# EAGLE schematic WagaGSMv3 (EAGLE 9.0.1)
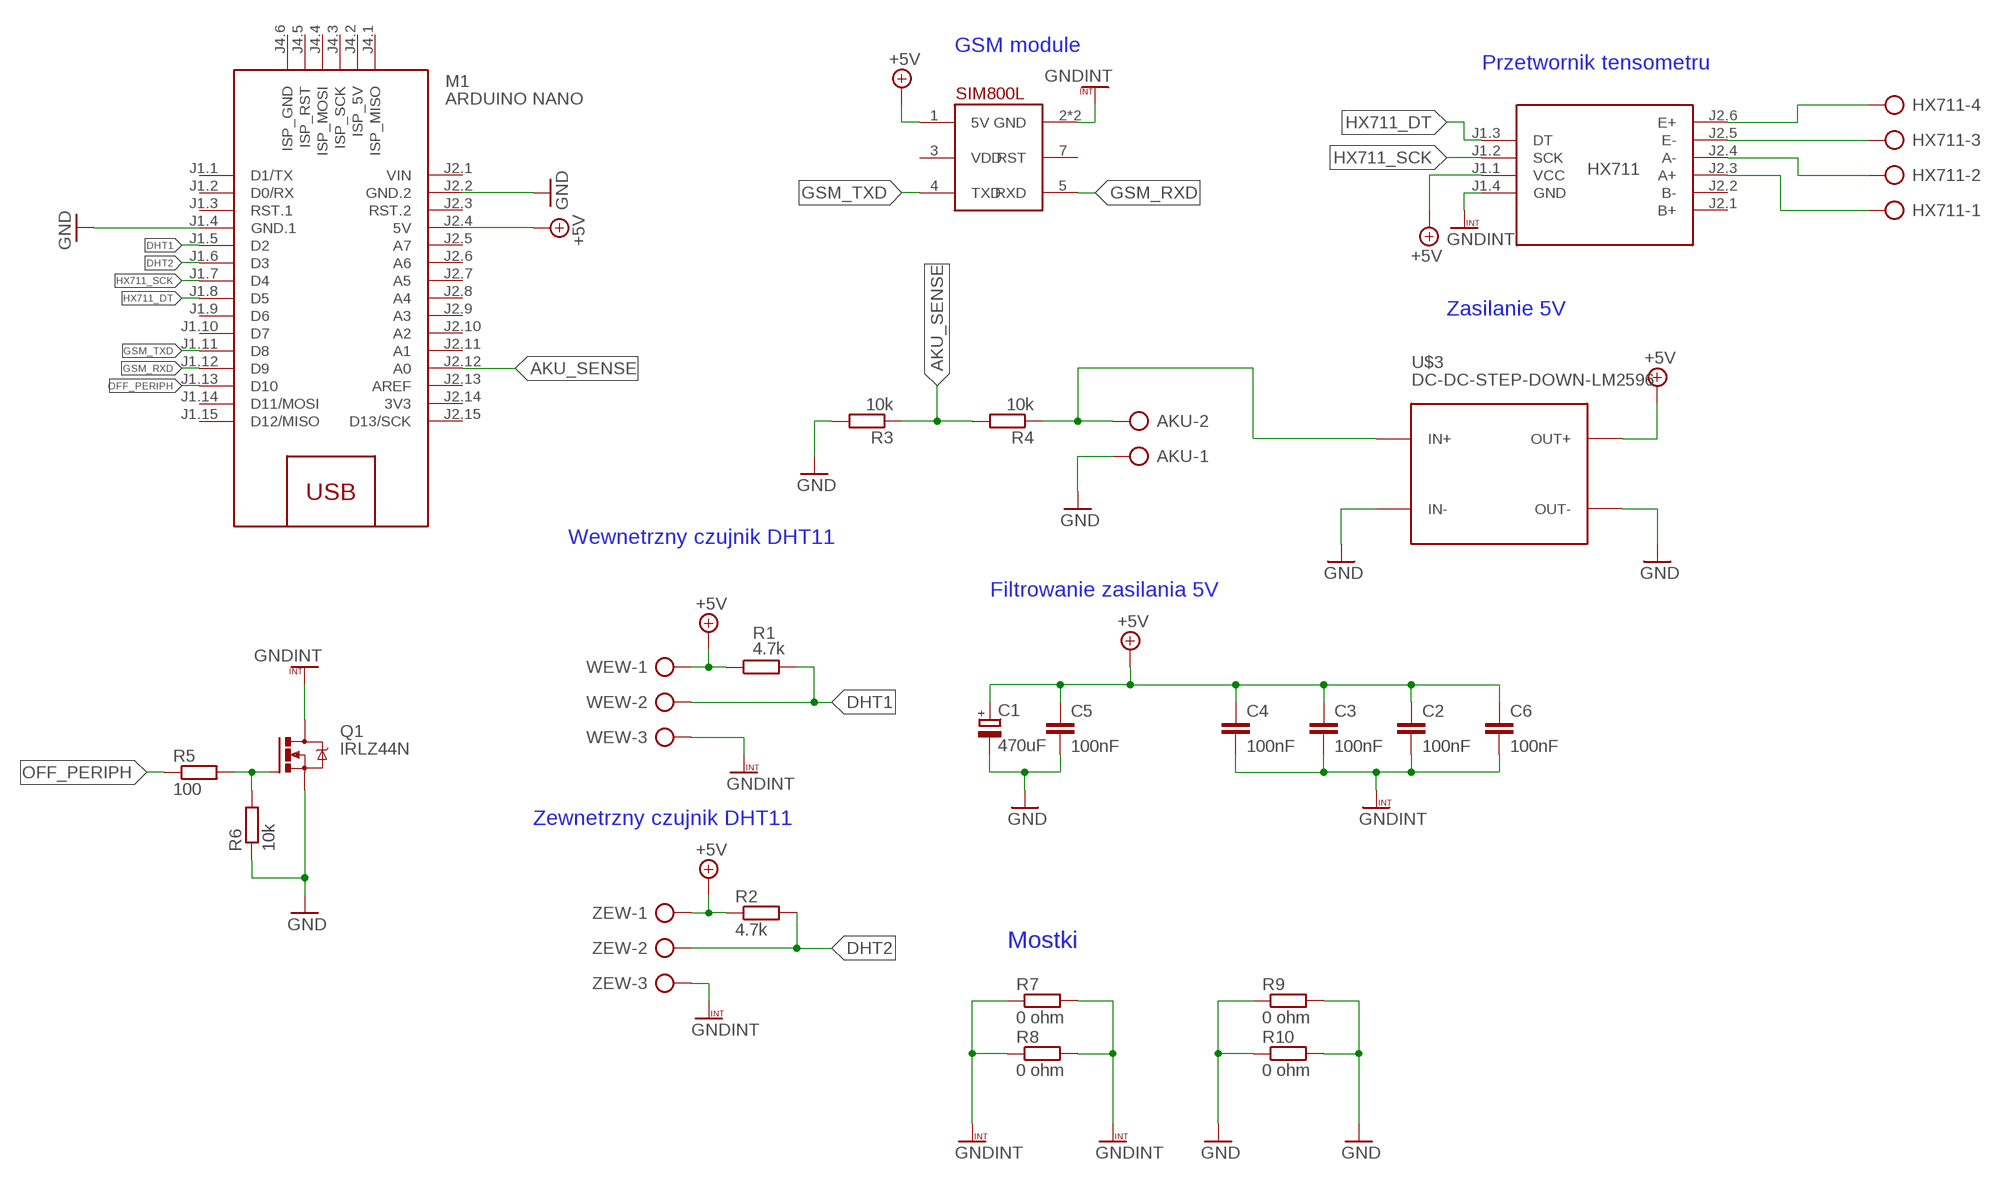
[diagram p0: schematic, sheet 1]

## Parts
AKU  AK500/2-H  [AK500/2-H]
C1  470uF  CPOL-EUE5-10.5  [E5-10,5]
C2  100nF  C-EU050-030X075  [C050-030X075]
C3  100nF  C-EU050-030X075  [C050-030X075]
C4  100nF  C-EU050-030X075  [C050-030X075]
C5  100nF  C-EU050-030X075  [C050-030X075]
C6  100nF  C-EU050-030X075  [C050-030X075]
HX711  AK300/4  [AK300/4]
M1  ARDUINO NANO  ARDUINO-NANO-3.0#ISP  [ARDUINO-NANO-3.0#ISP]
Q1  IRLZ44N  IRFZ48Z  [TO220BH]
R1  4.7k  R-EU_0204/7  [0204/7]
R2  4.7k  R-EU_0204/7  [0204/7]
R3  10k  R-EU_0207/10  [0207/10]
R4  10k  R-EU_0207/10  [0207/10]
R5  100  R-EU_0207/7  [0207/7]
R6  10k  R-EU_0207/7  [0207/7]
R7  0 ohm  R-EU_0204/7  [0204/7]
R8  0 ohm  R-EU_0204/7  [0204/7]
R9  0 ohm  R-EU_0204/7  [0204/7]
R10  0 ohm  R-EU_0204/7  [0204/7]
U$1  SIM800L  [SIP]
U$2  HX711  [HX711]
U$3  DC-DC-STEP-DOWN-LM2596  [DC-DC-STEP-DOWN-LM2596]
WEW  AK500/3-H  [AK500/3-H]
ZEW  AK500/3-H  [AK500/3-H]

## Nets
+5V: C1.+ C2.1 C3.1 C4.1 C5.1 C6.1 M1.J2.4(5V) R1.1 R2.1 U$1.1(5V) U$2.J1.1(VCC) U$3.OUT+ WEW.1 ZEW.1
AKU_SENSE: M1.J2.12(A0) R3.1 R4.2
DHT1: M1.J1.5(D2) R1.2 WEW.2
DHT2: M1.J1.6(D3) R2.2 ZEW.2
GND: AKU.1 C1.- C5.2 M1.J1.4(GND.1) M1.J2.2(GND.2) Q1.S R3.2 R6.1 R9.1 R9.2 R10.1 R10.2 U$3.IN- U$3.OUT-
GNDINT: C2.2 C3.2 C4.2 C6.2 Q1.D R7.1 R7.2 R8.1 R8.2 U$1.2(GND) U$1.6(GND) U$2.J1.4(GND) WEW.3 ZEW.3
GSM_RXD: M1.J1.12(D9) U$1.5(RXD)
GSM_TXD: M1.J1.11(D8) U$1.4(TXD)
HX711_DT: M1.J1.8(D5) U$2.J1.3(DT)
HX711_SCK: M1.J1.7(D4) U$2.J1.2(SCK)
N$1: Q1.G R5.2 R6.2
N$3: AKU.2 R4.1 U$3.IN+
N$9: HX711.4 U$2.J2.6(E+)
N$10: HX711.3 U$2.J2.5(E-)
N$11: HX711.2 U$2.J2.4(A-)
N$12: HX711.1 U$2.J2.3(A+)
OFF_PERIPH: M1.J1.13(D10) R5.1
Unconnected: M1.J1.1(D1/TX) M1.J1.2(D0/RX) M1.J1.3(RST.1) M1.J1.9(D6) M1.J1.10(D7) M1.J1.14(D11/MOSI) M1.J1.15(D12/MISO) M1.J2.3(RST.2) M1.J2.5(A7) M1.J2.6(A6) M1.J2.7(A5) M1.J2.8(A4) M1.J2.9(A3) M1.J2.10(A2) M1.J2.11(A1) M1.J2.13(AREF) M1.J2.15(D13/SCK) M1.J4.1(ISP_MISO) M1.J4.2(ISP_5V) M1.J4.3(ISP_SCK) M1.J4.4(ISP_MOSI) M1.J4.5(ISP_RST) M1.J4.6(ISP_GND) U$1.3(VDD) U$1.7(RST) U$2.J2.1(B+)

## Notes on the sheet
- GSM module
- Przetwornik tensometru
- Zasilanie 5V
- Wewnetrzny czujnik DHT11
- Filtrowanie zasilania 5V
- Zewnetrzny czujnik DHT11
- Mostki

## Power pins joined to a net without a drawn wire
3V3: M1.J2.14(3V3)
B-: U$2.J2.2(B-)
VIN: M1.J2.1(VIN)

## Library data of the parts
AKU = con-ptr500:AK500/2-H: CONNECTOR Aug. 2004 / PTR Meßtechnik: Die Bezeichnung der Serie AK505 wurde geändert. Es handelt sich hierbei um AK500 in horizontaler Ausführung.; OC_FARNELL: unknown; OC_NEWARK: unknown
C1 = rcl:CPOL-EU: POLARIZED CAPACITOR, European symbol
C2-C6 = rcl:C-EU: CAPACITOR, European symbol
HX711 = con-ptr500:AK300/4: CONNECTOR; OC_FARNELL: unknown; OC_NEWARK: unknown
M1 = 000_diy-modules:ARDUINO-NANO-3.0#ISP: Arduino Nano 3.0 (and compatible devices) with ISP pads More details available here: https://www.arduino.cc/en/Main/ArduinoBoardNano Click here to find device on ebay.com <http://www.ebay.com/sch/arduino+nano>
Q1 = transistor-power:IRFZ48: N Channel HEXFET® Power MOSFET Logic Level Source: http://www.irf.com/product-info/datasheets/data/irfz48z.pdf
R1-R10 = rcl:R-EU_: RESISTOR, European symbol
U$1 = SIM800L:SIM800L: SIM800L Blue EVB Board with Level Translation and diode dropper.
U$2 = 000_MojeElementy:HX711: Płytka z układem HX711 do obługi belek tensometrycznych
U$3 = 000_diy-modules:DC-DC-STEP-DOWN-LM2596: DC/DC Step-Down Regulator based on LM2596-ADJ chip LM2596 datasheet available here: http://www.ti.com/lit/ds/symlink/lm2596.pdf Click here to find device on ebay.com <http://www.ebay.com/sch/lm2596+power+regulator>
WEW ZEW = con-ptr500:AK500/3-H: CONNECTOR Aug. 2004 / PTR Meßtechnik: Die Bezeichnung der Serie AK505 wurde geändert. Es handelt sich hierbei um AK500 in horizontaler Ausführung.; OC_FARNELL: unknown; OC_NEWARK: unknown